# EAGLE design snappergps_board_2_2_0 (EAGLE 9.6.2)
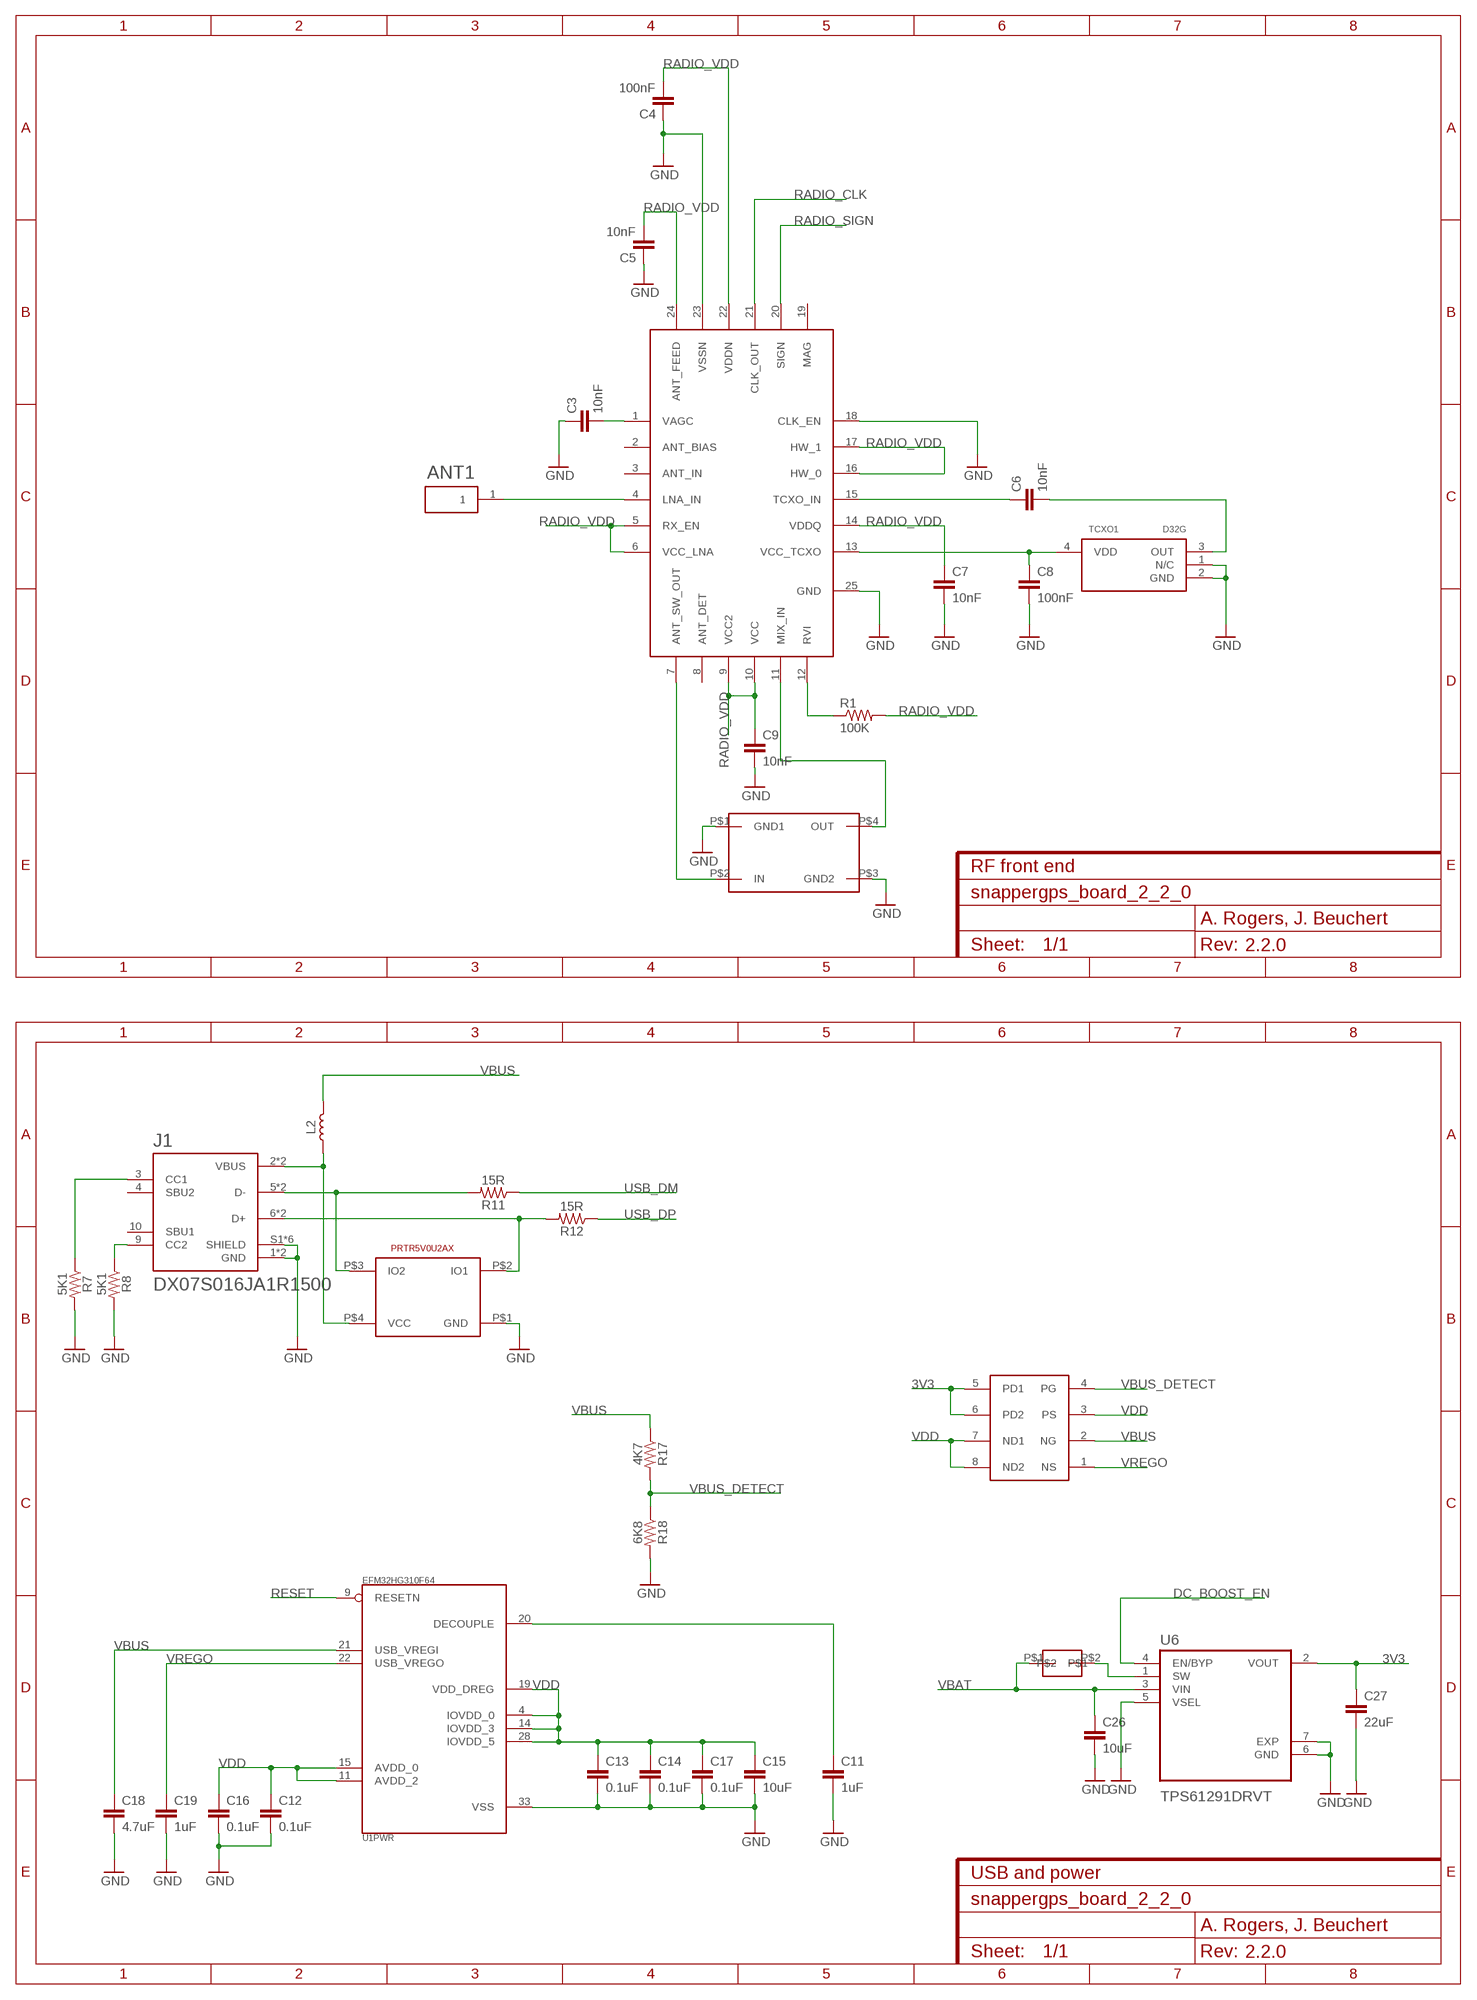
[diagram p0: schematic, sheet 1, part 1 of 2]
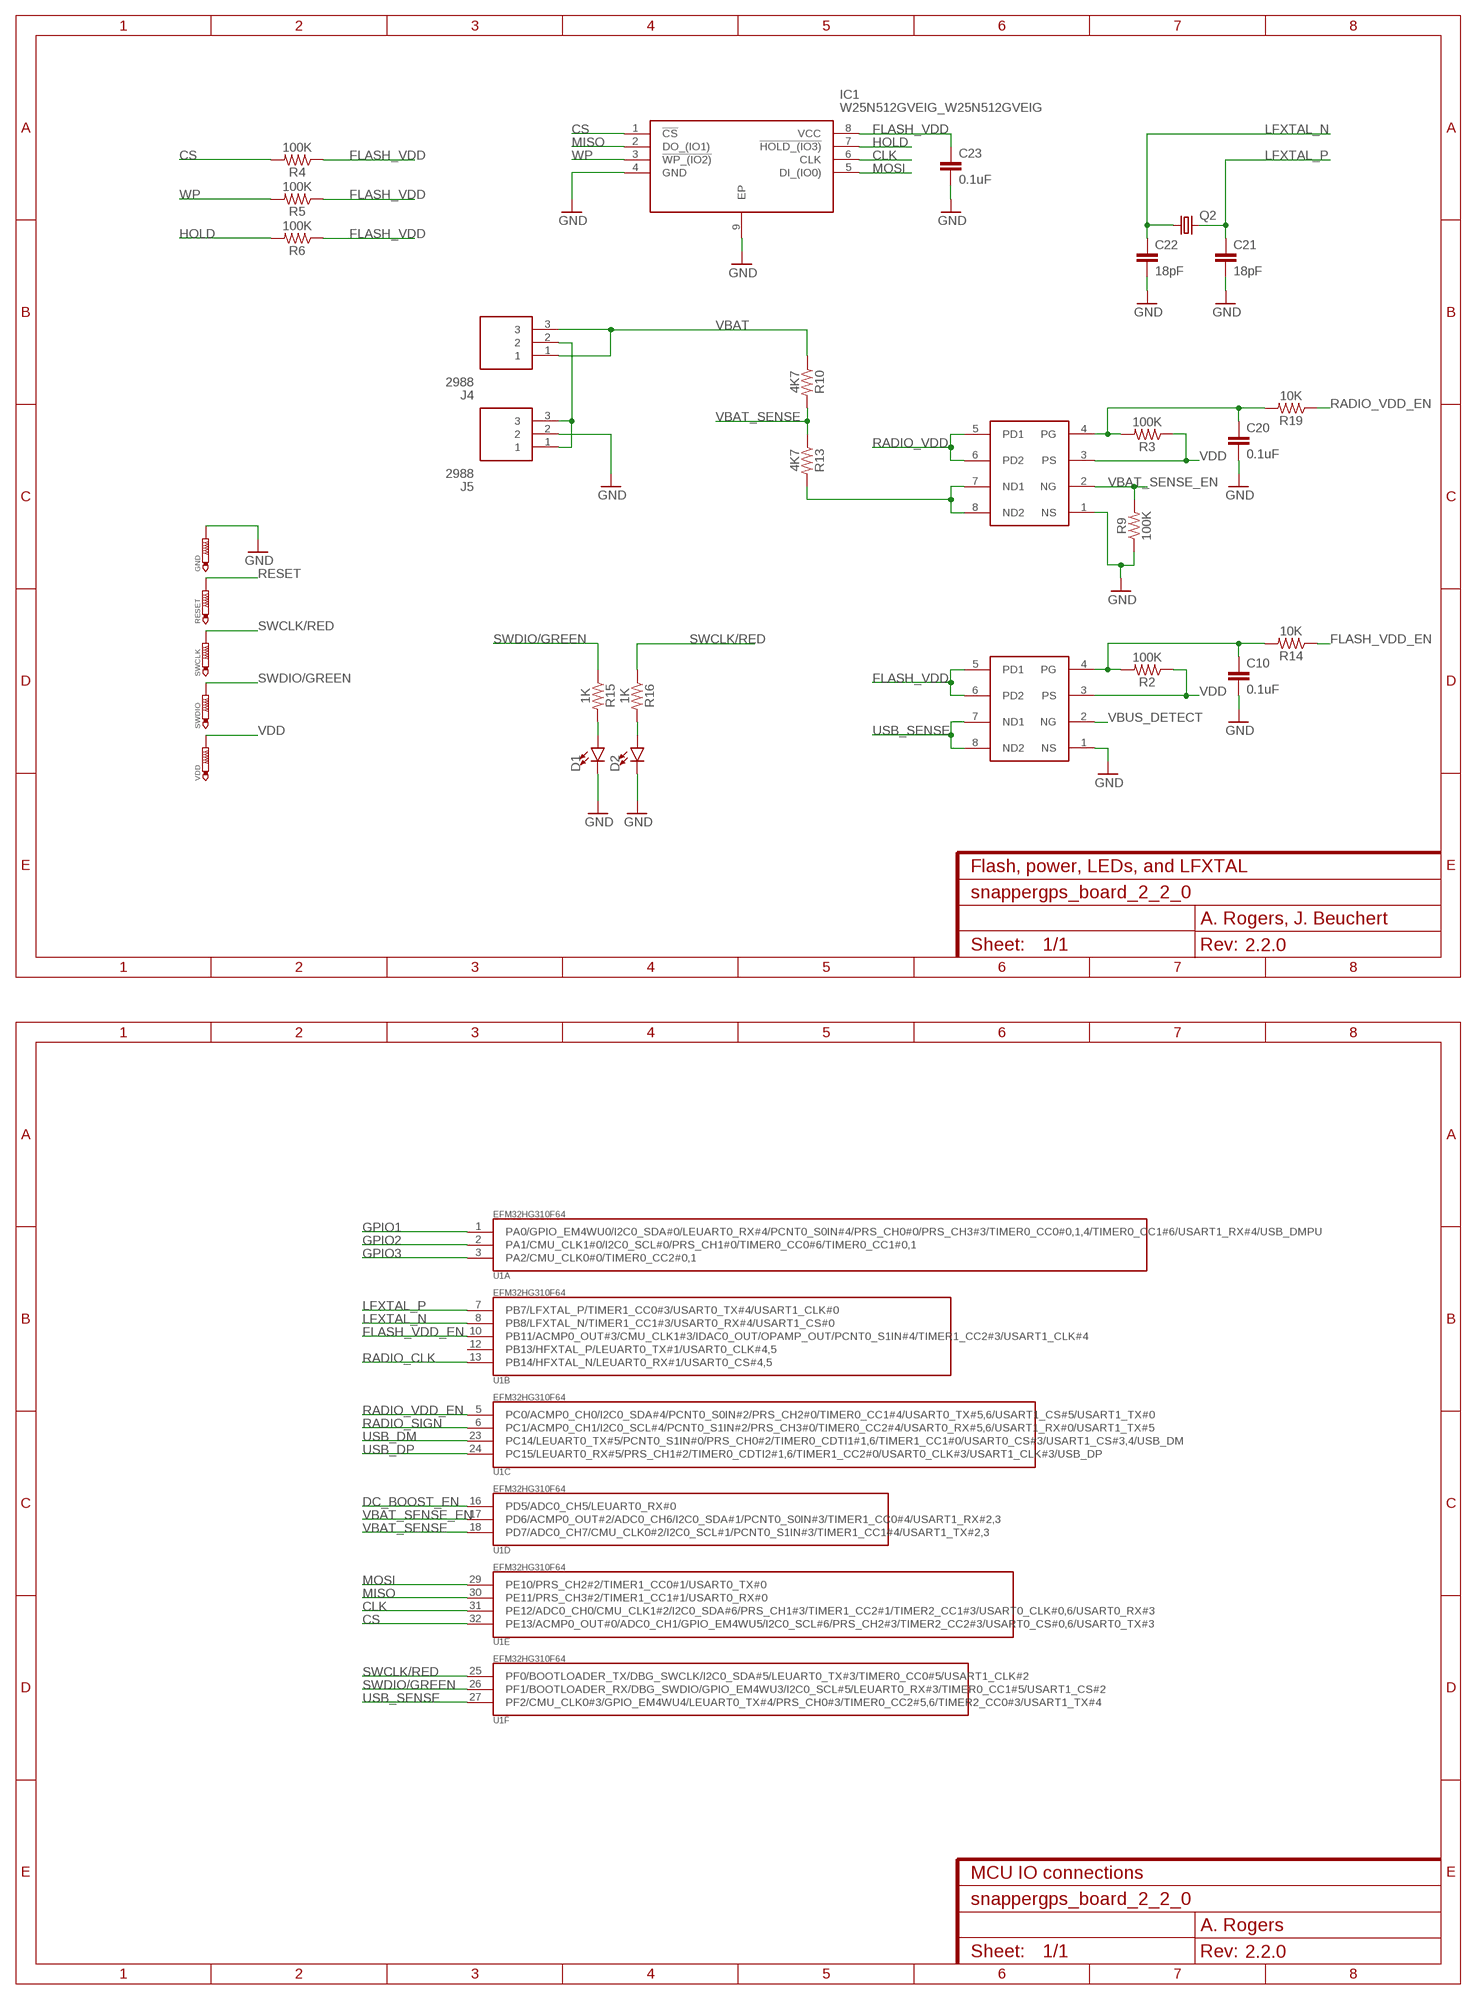
[diagram p1: schematic, sheet 1, part 2 of 2]
FRAME1 (FRAME-A4L): CNAME: RF front end; CREVISION: 2.2.0; DESIGNER: A. Rogers, J. Beuchert; REV: 2.2.0
FRAME2 (FRAME-A4L): CNAME: Flash, power, LEDs, and LFXTAL; CREVISION: 2.2.0; DESIGNER: A. Rogers, J. Beuchert
FRAME3 (FRAME-A4L): CNAME: USB and power; CREVISION: 2.2.0; DESIGNER: A. Rogers, J. Beuchert
FRAME4 (FRAME-A4L): CNAME: MCU IO connections; CREVISION: 2.2.0; DESIGNER: A. Rogers

## Parts
ANT1  GP.1575.25.2.A.02  [GP1575252A02]
C3  10nF  CAPACITOR_0402  [0402]
C4  100nF  CAPACITOR_0402  [0402]
C5  10nF  CAPACITOR_0402  [0402]
C6  10nF  CAPACITOR_0402  [0402]
C7  10nF  CAPACITOR_0402  [0402]
C8  100nF  CAPACITOR_0402  [0402]
C9  10nF  CAPACITOR_0402  [0402]
C10  0.1uF  CAPACITOR_0402  [0402]
C11  1uF  CAPACITOR_0603  [0603]
C12  0.1uF  CAPACITOR_0402  [0402]
C13  0.1uF  CAPACITOR_0402  [0402]
C14  0.1uF  CAPACITOR_0402  [0402]
C15  10uF  CAPACITOR_0603  [0603]
C16  0.1uF  CAPACITOR_0402  [0402]
C17  0.1uF  CAPACITOR_0402  [0402]
C18  4.7uF  CAPACITOR_0603  [0603]
C19  1uF  CAPACITOR_0603  [0603]
C20  0.1uF  CAPACITOR_0402  [0402]
C21  18pF  CAPACITOR_0402  [0402]
C22  18pF  CAPACITOR_0402  [0402]
C23  0.1uF  CAPACITOR_0402  [0402]
C26  10uF  C-EUC0603K  [C0603K]
C27  22uF  C-EUC0603K  [C0603K]
D1  LED0603  [LED-0603]
D2  LED0603  [LED-0603]
GND  PTR1B1,27  [B1,27]
IC1  W25N512GVEIG_W25N512GVEIG  [W25N512GVEIG_SON127P800X600X80-9N]
J1  DX07S016JA1R1500  [JAE_DX07S016JA1R1500]
J4  2988  [2988]
J5  2988  [2988]
L2  INDUCTOR  [0402]
Q1  TT8M1TRAMANDA  [AMANDA_TSST8]
Q2  CRYSTAL_JTX310  [3.2X1.5]
Q3  TT8M1TRAMANDA  [AMANDA_TSST8]
Q4  TT8M1TRAMANDA  [AMANDA_TSST8]
R1  100K  RESISTOR_0402  [0402]
R2  100K  RESISTOR_0402  [0402]
R3  100K  RESISTOR_0402  [0402]
R4  100K  RESISTOR_0402  [0402]
R5  100K  RESISTOR_0402  [0402]
R6  100K  RESISTOR_0402  [0402]
R7  5K1  RESISTOR_0402  [0402]
R8  5K1  RESISTOR_0402  [0402]
R9  100K  RESISTOR_0402  [0402]
R10  4K7  RESISTOR_0402  [0402]
R11  15R  RESISTOR_0402  [0402]
R12  15R  RESISTOR_0402  [0402]
R13  4K7  RESISTOR_0402  [0402]
R14  10K  RESISTOR_0402  [0402]
R15  1K  RESISTOR_0402  [0402]
R16  1K  RESISTOR_0402  [0402]
R17  4K7  RESISTOR_0402  [0402]
R18  6K8  RESISTOR_0402  [0402]
R19  10K  RESISTOR_0402  [0402]
RESET  PTR1B1,27  [B1,27]
SAW1  SAW_FILTER  [SAW_FILTER]
SWCLK  PTR1B1,27  [B1,27]
SWDIO  PTR1B1,27  [B1,27]
TCXO1  D32G  [D32G]
U1  EFM32HG310F64  [QFN32]
U2  RF_CIRCUIT-SE4150L  [QFN50P400X400X90-25N]
U3  TVS_DIODE-PRTR5V0U2AX  [TVS_DIODE-PRTR5V0U2AX]
U6  TPS61291DRVT  [SON65P200X200X80-7N]
U7  MDMK2020T3R3MM  [MDMK2020T3R3MM]
VDD  PTR1B1,27  [B1,27]

## Nets
3V3: C27.1 Q4.5(PD1) Q4.6(PD2) U6.2(VOUT)
CLK: IC1.6(CLK) U1.31(E:PE12/ADC0_CH0/CMU_CLK1#2/I2C0_SDA#6/PRS_CH1#3/TIMER1_CC2#1/TIMER2_CC1#3/USART0_CLK#0,6/USART0_RX#3)
CS: IC1.1(!CS) R4.2 U1.32(E:PE13/ACMP0_OUT#0/ADC0_CH1/GPIO_EM4WU5/I2C0_SCL#6/PRS_CH2#3/TIMER2_CC2#3/USART0_CS#0,6/USART0_TX#3)
DC_BOOST_EN: U1.16(D:PD5/ADC0_CH5/LEUART0_RX#0) U6.4(EN/BYP)
FLASH_VDD: C23.1 IC1.8(VCC) Q3.5(PD1) Q3.6(PD2) R4.1 R5.1 R6.1
FLASH_VDD_EN: R14.1 U1.10(B:PB11/ACMP0_OUT#3/CMU_CLK1#3/IDAC0_OUT/OPAMP_OUT/PCNT0_S1IN#4/TIMER1_CC2#3/USART1_CLK#4)
GND: C3.1 C4.1 C5.1 C7.2 C8.2 C9.2 C10.2 C11.2 C12.2 C13.2 C14.2 C15.2 C16.2 C17.2 C18.2 C19.2 C20.2 C21.2 C22.2 C23.2 C26.2 C27.2 D1.C D2.C GND.TP IC1.4(GND) IC1.9(EP) J1.1(GND) J1.12(GND) J1.S1(SHIELD) J1.S2(SHIELD) J1.S3(SHIELD) J1.S4(SHIELD) J1.S5(SHIELD) J1.S6(SHIELD) J5.2 Q1.1(NS) Q3.1(NS) R7.2 R8.2 R9.1 R18.2 SAW1.P$1(GND1) SAW1.P$3(GND2) TCXO1.1(N/C) TCXO1.2(GND) U1.33(PWR:VSS) U2.18(CLK_EN) U2.23(VSSN) U2.25(GND) U3.P$1(GND) U6.5(VSEL) U6.6(GND) U6.7(EXP)
GPIO1: U1.1(A:PA0/GPIO_EM4WU0/I2C0_SDA#0/LEUART0_RX#4/PCNT0_S0IN#4/PRS_CH0#0/PRS_CH3#3/TIMER0_CC0#0,1,4/TIMER0_CC1#6/USART1_RX#4/USB_DMPU)
GPIO2: U1.2(A:PA1/CMU_CLK1#0/I2C0_SCL#0/PRS_CH1#0/TIMER0_CC0#6/TIMER0_CC1#0,1)
GPIO3: U1.3(A:PA2/CMU_CLK0#0/TIMER0_CC2#0,1)
HOLD: IC1.7(!HOLD_(IO3)) R6.2
LFXTAL_N: C22.1 Q2.1 U1.8(B:PB8/LFXTAL_N/TIMER1_CC1#3/USART0_RX#4/USART1_CS#0)
LFXTAL_P: C21.1 Q2.2 U1.7(B:PB7/LFXTAL_P/TIMER1_CC0#3/USART0_TX#4/USART1_CLK#0)
MISO: IC1.2(DO_(IO1)) U1.30(E:PE11/PRS_CH3#2/TIMER1_CC1#1/USART0_RX#0)
MIXIN [rf]: SAW1.P$4(OUT) U2.11(MIX_IN)
MOSI: IC1.5(DI_(IO0)) U1.29(E:PE10/PRS_CH2#2/TIMER1_CC0#1/USART0_TX#0)
N$1: Q1.7(ND1) Q1.8(ND2) R13.2
N$2: C20.1 Q1.4(PG) R3.2 R19.2
N$3: J1.9(CC2) R8.1
N$4: J1.3(CC1) R7.1
N$5 [rf]: ANT1.1 U2.4(LNA_IN)
N$6: R1.1 U2.12(RVI)
N$7: U6.1(SW) U7.P$2
N$8 [rf]: SAW1.P$2(IN) U2.7(ANT_SW_OUT)
N$9: C8.1 TCXO1.4(VDD) U2.13(VCC_TCXO)
N$10: C6.1 U2.15(TCXO_IN)
N$11: C6.2 TCXO1.3(OUT)
N$13: C11.1 U1.20(PWR:DECOUPLE)
N$14: C10.1 Q3.4(PG) R2.2 R14.2
N$16: D1.A R15.2
N$17: D2.A R16.2
N$19: C3.2 U2.1(VAGC)
N$20: J4.2 J5.1 J5.3
N$26: J1.2(VBUS) J1.11(VBUS) L2.1 U3.P$4(VCC)
N$35: J1.6(D+) J1.7(D+) R12.2 U3.P$2(IO1)
N$36: J1.5(D-) J1.8(D-) R11.2 U3.P$3(IO2)
RADIO_CLK: U1.13(B:PB14/HFXTAL_N/LEUART0_RX#1/USART0_CS#4,5) U2.21(CLK_OUT)
RADIO_SIGN: U1.6(C:PC1/ACMP0_CH1/I2C0_SCL#4/PCNT0_S1IN#2/PRS_CH3#0/TIMER0_CC2#4/USART0_RX#5,6/USART1_RX#0/USART1_TX#5) U2.20(SIGN)
RADIO_VDD: C4.2 C5.2 C7.1 C9.1 Q1.5(PD1) Q1.6(PD2) R1.2 U2.5(RX_EN) U2.6(VCC_LNA) U2.9(VCC2) U2.10(VCC) U2.14(VDDQ) U2.16(HW_0) U2.17(HW_1) U2.22(VDDN) U2.24(ANT_FEED)
RADIO_VDD_EN: R19.1 U1.5(C:PC0/ACMP0_CH0/I2C0_SDA#4/PCNT0_S0IN#2/PRS_CH2#0/TIMER0_CC1#4/USART0_TX#5,6/USART1_CS#5/USART1_TX#0)
RESET: RESET.TP U1.9(PWR:RESETN)
SWCLK/RED: R16.1 SWCLK.TP U1.25(F:PF0/BOOTLOADER_TX/DBG_SWCLK/I2C0_SDA#5/LEUART0_TX#3/TIMER0_CC0#5/USART1_CLK#2)
SWDIO/GREEN: R15.1 SWDIO.TP U1.26(F:PF1/BOOTLOADER_RX/DBG_SWDIO/GPIO_EM4WU3/I2C0_SCL#5/LEUART0_RX#3/TIMER0_CC1#5/USART1_CS#2)
USB_DM: R11.1 U1.23(C:PC14/LEUART0_TX#5/PCNT0_S1IN#0/PRS_CH0#2/TIMER0_CDTI1#1,6/TIMER1_CC1#0/USART0_CS#3/USART1_CS#3,4/USB_DM)
USB_DP: R12.1 U1.24(C:PC15/LEUART0_RX#5/PRS_CH1#2/TIMER0_CDTI2#1,6/TIMER1_CC2#0/USART0_CLK#3/USART1_CLK#3/USB_DP)
USB_SENSE: Q3.7(ND1) Q3.8(ND2) U1.27(F:PF2/CMU_CLK0#3/GPIO_EM4WU4/LEUART0_TX#4/PRS_CH0#3/TIMER0_CC2#5,6/TIMER2_CC0#3/USART1_TX#4)
VBAT: C26.1 J4.1 J4.3 R10.1 U6.3(VIN) U7.P$1
VBAT_SENSE: R10.2 R13.1 U1.18(D:PD7/ADC0_CH7/CMU_CLK0#2/I2C0_SCL#1/PCNT0_S1IN#3/TIMER1_CC1#4/USART1_TX#2,3)
VBAT_SENSE_EN: Q1.2(NG) R9.2 U1.17(D:PD6/ACMP0_OUT#2/ADC0_CH6/I2C0_SDA#1/PCNT0_S0IN#3/TIMER1_CC0#4/USART1_RX#2,3)
VBUS: C18.1 L2.2 Q4.2(NG) R17.1 U1.21(PWR:USB_VREGI)
VBUS_DETECT: Q3.2(NG) Q4.4(PG) R17.2 R18.1
VDD: C12.1 C13.1 C14.1 C15.1 C16.1 C17.1 Q1.3(PS) Q3.3(PS) Q4.3(PS) Q4.7(ND1) Q4.8(ND2) R2.1 R3.1 U1.4(PWR:IOVDD_0) U1.11(PWR:AVDD_2) U1.14(PWR:IOVDD_3) U1.15(PWR:AVDD_0) U1.19(PWR:VDD_DREG) U1.28(PWR:IOVDD_5) VDD.TP
VREGO: C19.1 Q4.1(NS) U1.22(PWR:USB_VREGO)
WP: IC1.3(!WP_(IO2)) R5.2
Unconnected: J1.4(SBU2) J1.10(SBU1) U1.12(B:PB13/HFXTAL_P/LEUART0_TX#1/USART0_CLK#4,5) U2.2(ANT_BIAS) U2.3(ANT_IN) U2.8(ANT_DET) U2.19(MAG)

## Library data of the parts
ANT1 = GP.1575.25.2.A.02:GP.1575.25.2.A.02: Antennas GPS THRU-HL PIN PASV PTCH ANT Source: Datasheet <https://www.mouser.com/datasheet/2/398/GP.1575.25.2.A.02-1219629.pdf>; ARROW_PART_NUMBER: GP.1575.25.2.A.02; ARROW_PRICE-STOCK: https://www.arrow.com/en/products/gp.1575.25.2.a.02/taoglas?region=nac; DESCRIPTION: Antennas GPS THRU-HL PIN PASV PTCH ANT; HEIGHT: 2.8mm; MANUFACTURER_NAME: Taoglas; MANUFACTURER_PART_NUMBER: GP.1575.25.2.A.02; MOUSER_PART_NUMBER: 960-GP1575252A02; MOUSER_PRICE-STOCK: https://www.mouser.co.uk/ProductDetail/Taoglas/GP1575252A02?qs=WUa1z%2FNV9%252B0rNVEYL1BhmQ%3D%3D
C3-C23 = bird_variant_2:CAPACITOR
C26 C27 = rcl:C-EU: CAPACITOR, European symbol
D1 D2 = bird_variant_2:LED: LED (Generic) Standard schematic elements and footprints for 5mm, 3mm, 1206, and 0603 sized LEDs. Generic LEDs with no color specified.
GND RESET SWCLK SWDIO VDD = testpad:PTR1: TEST PIN
IC1 = snappergps_board_2_9_four_layers:W25N512GVEIG_W25N512GVEIG: NAND Flash 512Mb Serial NAND flash, 3V Source: Datasheet <https://www.winbond.com/resource-files/w25n512gv rev c 112118.pdf>; DESCRIPTION: NAND Flash 512Mb Serial NAND flash, 3V; HEIGHT: 0.8mm; MANUFACTURER_NAME: Winbond; MANUFACTURER_PART_NUMBER: W25N512GVEIG; MOUSER_PART_NUMBER: 454-W25N512GVEIG; MOUSER_PRICE-STOCK: https://www.mouser.co.uk/ProductDetail/Winbond/W25N512GVEIG/?qs=qSfuJ%252Bfl%2Fd5ygZJQb1vhdQ%3D%3D
J1 = DX07S016JA1R1500:DX07S016JA1R1500: USB-C (USB TYPE-C) USB 2.0 Receptacle Connector 24 (16+8 Dummy) Position Surface Mount, Right Angle; Through Hole Check prices <https://pricing.snapeda.com/parts/DX07S016JA1R1500/JAE%20Electronics/view-part?ref=eda>; AVAILABILITY: In Stock; DESCRIPTION: USB-C (USB TYPE-C) USB 2.0 Receptacle Connector 24 (16+8 Dummy) Position Surface Mount, Right Angle; Through Hole; MF: JAE Electronics; MP: DX07S016JA1R1500; PACKAGE: None; PRICE: None
J4 J5 = 2988:2988: KEYSTONE - 2988 - BATTERY CONTACT, 7.9MM HEAR AID CELL, SURFACE MT Source: Datasheet <https://compone2988Datasheet(PDF)ntsearchengine.com/Datasheets/1/2988.pdf>; DESCRIPTION: KEYSTONE - 2988 - BATTERY CONTACT, 7.9MM HEAR AID CELL, SURFACE MT; HEIGHT: 5.85mm; MANUFACTURER_NAME: Keystone Electronics; MANUFACTURER_PART_NUMBER: 2988; MOUSER_PART_NUMBER: 534-2988; MOUSER_PRICE-STOCK: https://www.mouser.co.uk/ProductDetail/Keystone-Electronics/2988?qs=poiiR8sYdC%252BudAsPvK4uKw%3D%3D
L2 = bird_variant_2:INDUCTOR
Q1 Q3 Q4 = TT8M1TR-dual-np-mosfet:TT8M1TR
Q2 = bird_variant_2:CRYSTAL_JTX310: 3.2x1.5 SMD crystal
R1-R19 = bird_variant_2:RESISTOR: Generic Resistor Package
SAW1 = bird_variant_2:SAW_FILTER
TCXO1 = TCXO_test_brd_2_2:D32G
U1 = EFM32:EFM32HG310F64: EFM32HG310F64 Happy Microcontroller in 6mm x 6mm QFN32 package
U2 = bird_variant_2:RF_CIRCUIT-SE4150L
U3 = bird_variant_2:TVS_DIODE-PRTR5V0U2AX
U6 = TPS61291DRVT:TPS61291DRVT: Check prices <https://pricing.snapeda.com/parts/TPS61291DRVT/Texas%20Instruments/view-part?ref=eda>; AVAILABILITY: Good; DESCRIPTION: Low Iq Boost Converter with 15nA Bypass Operation 6-WSON -40 to 85; MF: Texas Instruments; MP: TPS61291DRVT; PACKAGE: WSON-6 Texas Instruments; PRICE: None; PURCHASE-URL: https://pricing.snapeda.com/search/part/TPS61291DRVT/?ref=eda
U7 = alex:MDMK2020T3R3MM

## Net classes
0 default: width 0.152 mm, drill 0.305 mm, clearance 0.152 mm
2 rf: clearance 0.33 mm

## Board
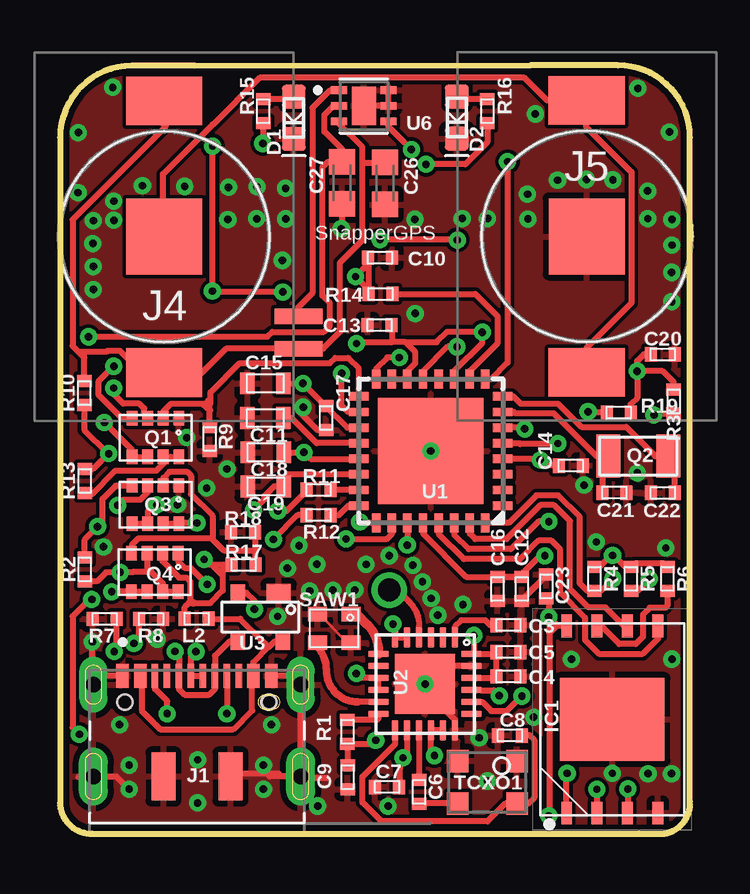
[diagram p2: board, top side]
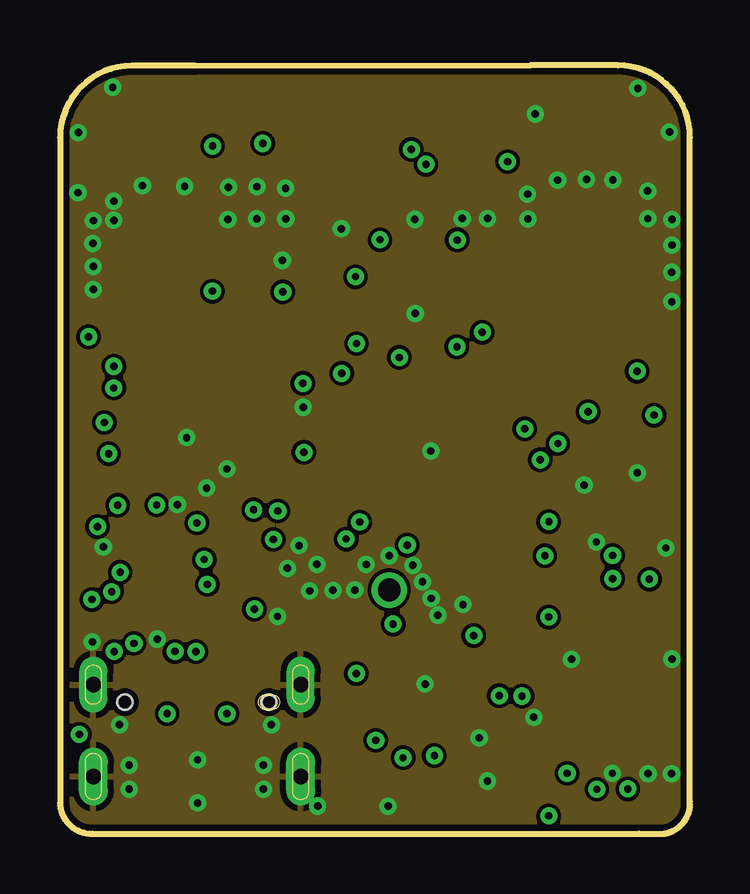
[diagram p3: board, inner layer Route2]
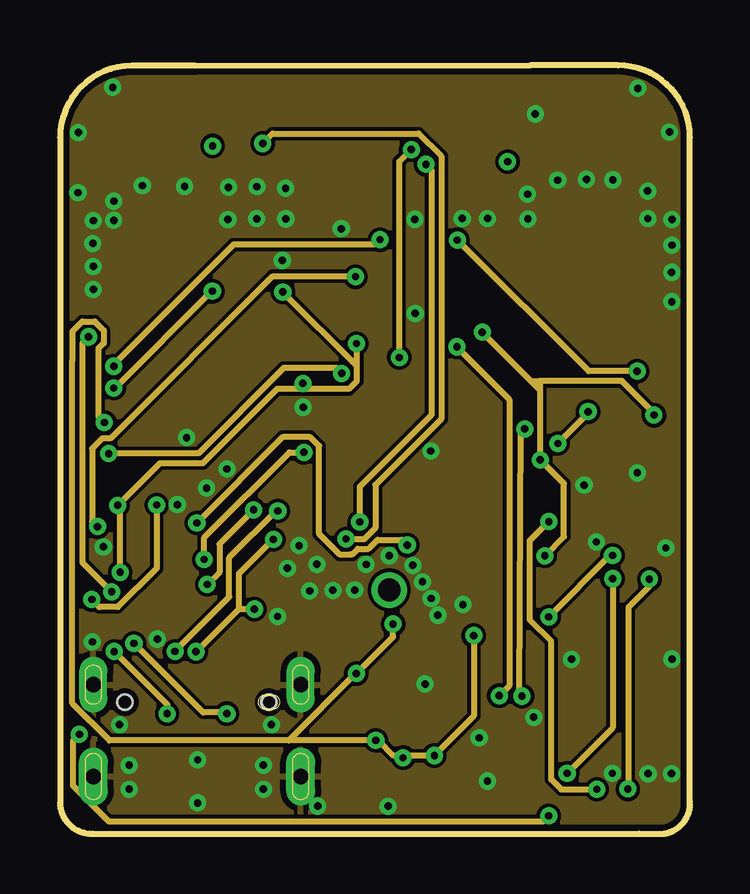
[diagram p4: board, inner layer Route15]
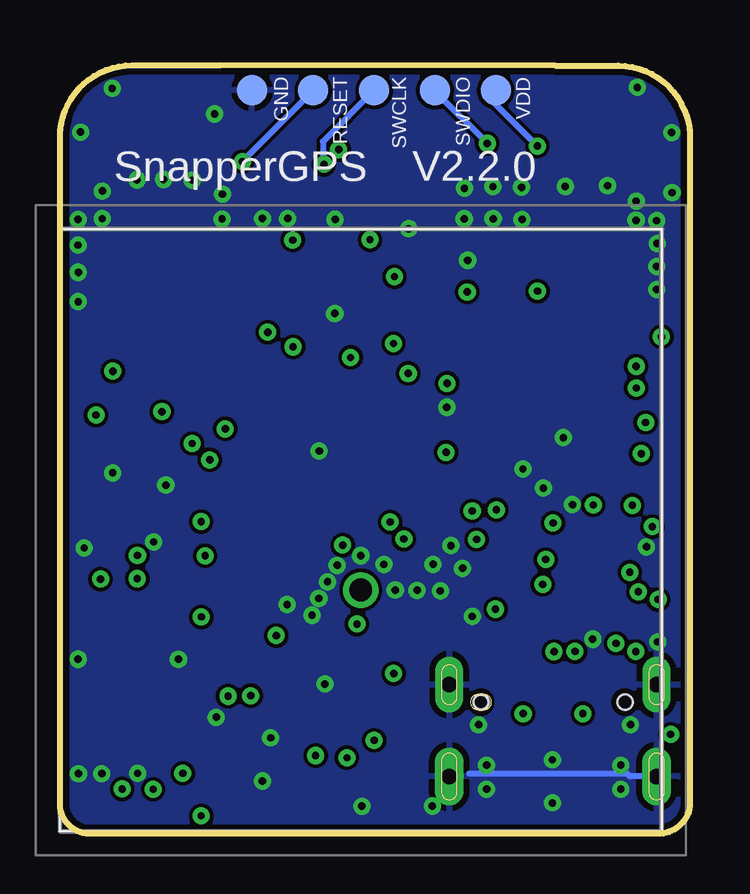
[diagram p5: board, bottom side, seen from below]

Size 26.27 x 32.03 mm. Coordinates in mm from the lower left corner, seen from the top.
Outline: 5.62,32.02 3,32.02 arc90 0,29.02 0,1.28 arc90 1.35,0 24.14,0 25.19,0 arc85 26.27,1.33 26.27,29.03 arc90 23.27,32.03 19.61,32.03 5.62,32.02
Copper layers (1+2*15+16): Top 0.035mm / dielectric 0.11mm / Route2 0.035mm / dielectric 0.4mm / Route15 0.035mm / dielectric 0.11mm / Bottom 0.035mm
Design rules "default *": minimum track width 10mil, minimum drill 18mil, track to track 6mil, track to pad 6mil, pad to pad 6mil, via to via 6mil, smd to smd 6mil, copper to edge 10mil, drill to drill 8mil, minimum pad ring 10mil, minimum via ring 8mil, stop-mask expansion 4mil, vias tented up to drill 20mil, thermal gap 10mil

### Footprints (pad centres in the part's own frame; a part is rotated, then mirrored left to right if it is on the bottom)
GP1575252A02 = drill 0.95 pad 1.478: 1 0,0
0402 = smd 0.5 x 0.6: 1 -0.5,0; 2 0.5,0
0603 = smd 0.6 x 0.9: 1 -0.75,0; 2 0.75,0
C0603K = smd 1.05 x 1.08: 1 -0.875,0; 2 0.875,0
LED-0603 = smd 1 x 1: A -0.877,0; C 0.877,0
B1,27 = smd 1.27 x 1.27: TP 0,0
W25N512GVEIG_SON127P800X600X80-9N = smd 0.95 x 0.45: 1 -3.9,1.905; 2 -3.9,0.635; 3 -3.9,-0.635; 4 -3.9,-1.905; 5 3.9,-1.905; 6 3.9,-0.635; 7 3.9,0.635; 8 3.9,1.905 | smd 3.45 x 4.35: 9 0,0
JAE_DX07S016JA1R1500 = smd 0.52 x 1: 1 -3.1,1.1; 2 -2.35,1.1; 11 2.35,1.1; 12 3.1,1.1 | smd 0.27 x 1: 3 -1.75,1.1; 4 -1.25,1.1; 5 -0.75,1.1; 6 -0.25,1.1; 7 0.25,1.1; 8 0.75,1.1; 9 1.25,1.1; 10 1.75,1.1 | smd 1 x 2: S1 -1.4,-3.1; S2 1.4,-3.1 | drill 0.65 long: S3 -4.32,0.725; S4 4.32,0.725 | drill 0.65 pad 1.2 long: S5 -4.32,-3.1; S6 4.32,-3.1 | hole 0.6: 3,0 | hole 0.63: 3,0; -3,0
2988 = smd 2.03 x 3.18: 1 -5.665,0; 3 5.665,0 | smd 3.17 x 3.17: 2 0,0
AMANDA_TSST8 = smd 0.45 x 0.6: 1 -0.975,-0.8; 2 -0.325,-0.8; 3 0.325,-0.8; 4 0.975,-0.8; 5 0.975,0.8; 6 0.325,0.8; 7 -0.325,0.8; 8 -0.975,0.8
3.2X1.5 = smd 1 x 1.8: 1 -1.25,0; 2 1.25,0
SAW_FILTER = smd 0.8 x 0.6: P$1 -0.7,0.6; P$2 -0.7,-0.6; P$3 0.7,-0.6; P$4 0.7,0.6
D32G = smd 0.94 x 0.89: 1 0.885,-1.24; 2 0.885,1.24; 3 -0.885,1.24; 4 -0.885,-1.24
QFN32 = smd 0.8 x 0.35: 1 -3,2.275; 2 -3,1.625; 3 -3,0.975; 4 -3,0.325; 5 -3,-0.325; 6 -3,-0.975; 7 -3,-1.625; 8 -3,-2.275; 17 3,-2.275; 18 3,-1.625; 19 3,-0.975; 20 3,-0.325; 21 3,0.325; 22 3,0.975; 23 3,1.625; 24 3,2.275 | smd 0.35 x 0.8: 9 -2.275,-3; 10 -1.625,-3; 11 -0.975,-3; 12 -0.325,-3; 13 0.325,-3; 14 0.975,-3; 15 1.625,-3; 16 2.275,-3; 25 2.275,3; 26 1.625,3; 27 0.975,3; 28 0.325,3; 29 -0.325,3; 30 -0.975,3; 31 -1.625,3; 32 -2.275,3 | smd 4.4 x 4.4: 33 0,0
QFN50P400X400X90-25N = smd 0.86 x 0.27: 1 -1.935,1.25; 2 -1.935,0.75; 3 -1.935,0.25; 4 -1.935,-0.25; 5 -1.935,-0.75; 6 -1.935,-1.25; 13 1.935,-1.25; 14 1.935,-0.75; 15 1.935,-0.25; 16 1.935,0.25; 17 1.935,0.75; 18 1.935,1.25 | smd 0.27 x 0.86: 7 -1.25,-1.935; 8 -0.75,-1.935; 9 -0.25,-1.935; 10 0.25,-1.935; 11 0.75,-1.935; 12 1.25,-1.935; 19 1.25,1.935; 20 0.75,1.935; 21 0.25,1.935; 22 -0.25,1.935; 23 -0.75,1.935; 24 -1.25,1.935 | smd 2.5 x 2.5: 25 0,0
TVS_DIODE-PRTR5V0U2AX = smd 1.016 x 0.711: P$1 -0.762,-1.016 | smd 0.61 x 0.686: P$2 0.94,-1.016; P$3 0.94,1.016; P$4 -0.94,1.016
SON65P200X200X80-7N = smd 0.66 x 0.32: 1 -1.025,0.65; 2 -1.025,0; 3 -1.025,-0.65; 4 1.025,-0.65; 5 1.025,0; 6 1.025,0.65 | smd 1 x 1.6: 7 0,0
MDMK2020T3R3MM = smd 2 x 0.65: P$1 0,0.675; P$2 0,-0.675

### Placement (x,y rotation side)
ANT1  13.73,10.16 0 bottom
C3  18.71,8.7 180 top
C4  18.71,6.56 180 top
C5  18.71,7.57 180 top
C6  14.97,1.74 270 top
C7  13.64,1.95 180 top
C8  18.77,4.1 180 top
C9  11.99,2.35 270 top
C10  13.34,24.02 0 top
C11  8.57,17.33 180 top
C12  19.26,10.2 270 top
C13  13.33,21.2 180 top
C14  21.3,15.35 0 top
C15  8.57,18.78 180 top
C16  18.24,10.2 270 top
C17  11.1,17.33 270 top
C18  8.58,15.9 180 top
C19  8.58,14.48 180 top
C20  25.13,19.98 0 top
C21  23.12,14.22 0 top
C22  25.14,14.21 180 top
C23  20.27,10.31 90 top
C26  13.55,27.11 270 top
C27  11.76,27.13 270 top
D1  9.75,29.84 270 top
D2  16.55,29.85 270 top
GND  18.25,30.99 90 bottom
IC1  23.03,4.76 90 top
J1  5.71,5.49 0 top
J4  4.35,24.89 90 top
J5  21.96,24.9 270 top
L2  5.71,8.96 180 top
Q1  3.98,16.51 180 top
Q2  24.12,15.74 180 top
Q3  3.98,13.72 180 top
Q4  3.96,10.9 180 top
R1  11.99,4.25 270 top
R2  1.04,11.02 90 top
R3  25.59,18.03 90 top
R4  22.28,10.63 270 top
R5  23.81,10.63 270 top
R6  25.33,10.63 270 top
R7  1.87,8.95 180 top
R8  3.8,8.95 0 top
R9  6.24,16.46 90 top
R10  1.02,18.37 270 top
R11  10.77,14.33 180 top
R12  10.78,13.28 180 top
R13  1.04,14.71 270 top
R14  13.36,22.5 180 top
R15  8.48,30.12 90 top
R16  17.82,30.13 90 top
R17  7.67,11.21 0 top
R18  7.64,12.57 180 top
R19  23.3,17.56 0 top
RESET  15.71,30.99 90 bottom
SAW1  11.44,8.56 180 top
SWCLK  13.17,30.99 90 bottom
SWDIO  10.63,30.99 90 bottom
TCXO1  17.82,2.14 90 top
U1  15.46,15.96 180 top
U2  15.23,6.24 270 top
U3  8.35,9.03 180 top
U6  12.67,30.34 0 top
U7  9.94,20.9 180 top
VDD  8.09,30.99 90 bottom

### Tracks (layer width: path | path; a pad name or v marks a point on that pad's centre or on a via)
3V3  (via drill 0.3)
  Top 0.254: Q4.6 Q4.5 2.17,10.1 v2.15,10.09 | U6.2 11.4,30.34 11.03,29.97 11.03,29.27 11.76,28.53 C27.1 11.16,28 10.94,27.78 10.94,22.43 11.26,22.11 11.26,21.17 11.01,20.92 8.84,20.92 8.64,20.71 v1.19,20.71
  Route15 0.254: v1.19,20.71 0.93,20.45 0.93,11.31 v2.15,10.09
CLK
  Top 0.254: IC1.6 23.51,8.66 22.74,9.44 22.03,9.44 21.26,10.2 21.26,13.04 20.6,13.7 20.03,13.7 18.62,12.29 18.62,12.28 17.32,12.28 17.09,12.51 U1.31
CS  (via drill 0.3)
  Top 0.254: IC1.1 21.12,2.52 v21.15,2.52 | v23.05,10.63 22.54,10.13 R4.2 21.98,10.13 21.67,10.44 21.67,13.22 20.78,14.1 19.86,14.1 18.71,12.96 U1.32
  Route15 0.254: v21.15,2.52 23.05,4.42 v23.05,10.63
DC_BOOST_EN  (via drill 0.3)
  Top 0.254: v14.15,19.85 13.65,19.85 13.19,19.39 U1.16 | v14.65,28.52 13.69,29.48 U6.4
  Route15 0.254: v14.65,28.52 14.14,28.02 14.14,19.86 v14.15,19.85
FLASH_VDD  (via drill 0.3)
  Top 0.254: R6.1 25.19,11.27 23.95,11.27 R5.1 23.58,11.13 23.1,11.6 v23.04,11.6 22.96,11.6 22.49,11.13 R4.1 | v4.03,13.7 3.92,13.7 3.66,13.44 Q3.6 Q3.5 | IC1.8 20.75,8.66 | 20.75,8.66 20.48,8.93 | 20.48,8.93 20.4,9.02 | C23.1 20.4,9.69 20.4,9.05 | 20.4,9.02 v20.38,9.03 20.4,9.05 | 20.4,9.02 20.4,8.35 | 20.4,8.35 20.4,0.76 v20.38,0.74 | v1.33,9.76 1.23,9.76 0.53,9.06 0.53,4.42 v0.81,4.14 | 20.75,8.66 20.71,8.66 20.4,8.35 | 20.4,8.35 | 20.4,9.05 20.48,9.13 20.48,8.93
  Route15 0.254: v20.38,9.03 20.38,9.05 22.93,11.6 v23.04,11.6 | v4.03,13.7 4.03,11.07 2.42,9.45 1.64,9.45 v1.33,9.76 | v0.81,4.14 0.53,3.87 0.53,2.01 2.03,0.51 20.15,0.51 v20.38,0.74
FLASH_VDD_EN
  Top 0.254: U1.10 17.09,19.29 18.25,20.45 18.25,21.57 17.32,22.5 R14.1
GND  (via drill 0.3)
  Top 0.127: 10.82,9.14 10.89,9.08 11.85,8.11 11.91,8.06 | 11.97,8 12.03,7.94
  Top 0.254: U2.23 14.59,6.99 U2.25 15.23,6 16.48,4.75 U2.18 | J1.1 1.88,6.59 1.39,6.1 J1.S3 1.35,6.21 v1.35,8 | J1.S5 1.32,2.31 | J1.S2 7.24,2.52 8.62,2.52 | 8.62,2.52 9.12,2.52 | J1.S6 10.11,2.31 11.12,2.31 | U6.6 U6.5 U6.7 | J1.S5 0.8,2.39 0.77,2.35 | C23.2 20.27,10.76 19.26,9.75 C12.2 | C27.2 11.76,25.22 v11.73,25.22 | J1.S6 J1.S4 9.66,6.59 J1.12 | J1.S5 2.35,2.39 v2.88,1.86 | J1.S6 8.75,2.39 8.62,2.52 | 10.84,9.16 SAW1.P$3 10.8,9.16 10.89,9.08 | C17.2 10.74,16.84 10.14,17.43 v10.14,17.78 | 12.12,7.96 SAW1.P$1 12,7.96 11.97,8 | 11.97,8 11.91,8.06 | 11.97,8 11.85,8.11
  Bottom 0.254: J1.S5 2.5,2.39 2.62,2.5 9.2,2.5
  other vias: 15.46,15.96 9.41,26.9 8.21,25.64 5.74,1.28 15.23,6.24 21.33,7.27 17.83,2.19 4.06,8.11 8.82,4.54 24.07,15.04 5.28,16.51 6.11,14.41 11.38,10.15 4.9,13.72 8.21,26.97 9.27,23.9 1.37,24.61 23.03,2.52 13.68,1.15 15.12,10.5 14.79,25.61 9.42,25.63 9.48,11.07 0.75,26.73 1.81,11.96 9.08,9.06 15.48,9.81 10.71,11.23 17.48,4 19.75,4.86 13.73,11.59 7.03,26.95 2.25,25.57 25.51,22.18 25.52,25.61 25.52,24.54 25.5,23.4 23.06,27.26 2.88,2.86 0.77,29.23 2.2,31.12 24.09,31.07 25.41,29.25 19.82,30.01 24.5,26.79 8.48,2.86 8.48,1.86 5.74,3.08 25.5,2.5 25.52,7.28 24.52,2.5 9.97,12.01 14.71,11.19 12.29,10.16 12.77,11.23 15.76,9.11 10.41,10.12 16.8,9.55 2.24,26.37 1.39,25.56 3.44,27.01 7,25.6 25.26,11.91 22.36,12.16 24.51,25.64 21.95,27.28 20.75,27.25 19.49,26.66 2.48,4.54 14.81,21.69 21.85,14.53 16.77,25.65 19.51,25.63 17.83,25.65 6.96,15.21 10.74,1.15 1.39,23.65 1.39,22.69 5.2,26.98
  pour Route2: -2.43,38.8 31.5,38.8 31.5,-1.08 -2.43,-1.08
  pour Top: -1.64,38.32 31.07,38.32 31.07,-0.76 -1.64,-0.76
  pour Bottom: -3.1,39.59 32.15,39.59 32.15,-1.6 -3.1,-1.6
  pour Route15: -2.82,39.25 31.91,39.25 31.91,-1.31 -2.82,-1.31
HOLD
  Top 0.254: IC1.7 22.57,8.66 23.32,7.91 24,7.91 24.31,8.21 24.31,9.13 24.59,9.42 25.24,9.42 25.33,9.51 R6.2
LFXTAL_N
  Top 0.254: U1.8 18.9,18.23 19.2,17.93 20.77,17.93 21.74,16.96 23.6,16.96 24.82,15.74 Q2.1 25.64,15.74 C22.1
LFXTAL_P
  Top 0.254: C21.1 22.62,15.5 Q2.2 22.37,15.74 20.59,17.52 18.97,17.52 18.91,17.58 U1.7
MISO  (via drill 0.3)
  Top 0.254: v22.39,1.85 v22.39,1.84 IC1.2 | U1.30 16.44,12.48 17.05,11.87 18.8,11.87 19.94,13.01 v20.38,13.01
  Route15 0.254: v22.39,1.85 20.9,1.85 20.49,2.26 20.49,8.01 19.58,8.91 19.58,12.21 v20.38,13.01
MIXIN
  Top 0.254: U2.11 12.43,5.49
  Top 0.305: 12.43,5.49 arc-90 11.11,6.82 arc45 10.67,7.86 SAW1.P$4 | SAW1.P$4 arc-90 10.64,7.96 SAW1.P$4
MOSI
  Top 0.254: IC1.5 24.93,8.13 24.3,7.5 22.46,7.5 21.89,8.07 21.89,9 20.86,10.03 20.86,11.85 20.48,12.22 19.96,12.22 19.19,11.45 16.84,11.45 15.79,12.51 U1.29
N$1
  Top 0.254: Q1.7 4.6,15.71 | 4.6,15.71 Q1.8 | 4.6,15.71 4.02,15.13 2.3,15.13 1.32,14.15 1.06,14.15 R13.2
N$2  (via drill 0.3)
  Top 0.254: v2.25,19.49 1.6,18.84 1.6,18.3 2.59,17.31 Q1.4 | v16.57,24.75 v16.57,24.76 16.57,24.76 v13.34,24.76 | v24.06,19.28 24.06,19.71 24.33,19.98 C20.1 | v24.06,19.28 v24.07,19.29 25.13,19.29 25.59,18.83 R3.2 | R19.2 23.8,17.9 24.06,18.17 v24.06,19.28
  Route15 0.254: v2.25,19.49 2.25,19.56 7.25,24.56 13.14,24.56 v13.34,24.76 | v24.06,19.28 22.05,19.28 16.58,24.75 v16.57,24.75
N$3  (via drill 0.3)
  Top 0.254: J1.9 v6.96,5 | R8.1 3.29,8.14 v3.08,7.93
  Route15 0.254: v3.08,7.93 v3.09,7.93 5.97,5.05 6.91,5.05 v6.96,5
N$4  (via drill 0.3)
  Top 0.254: J1.3 3.96,6.04 4.47,5.53 v4.47,5 | R7.1 2.35,8.94 2.35,7.69 v2.26,7.59
  Route15 0.254: v4.47,5 4.47,5.38 v2.26,7.59
N$5
  Top 0.254: U2.4 14.98,8.65 arc45 14.55,9.68 14.32,9.91 arc45 ANT1.1
N$6
  Top 0.254: U2.12 13.29,4.82 13.21,4.74 R1.1
N$7
  Top 0.254: U6.1 11.27,30.99 10.53,30.26 10.53,22.54 9.94,21.95 U7.P$2
N$8
  Top 0.381: U2.7 13.29,7.59 arc45 12.83,8.71 12.38,9.16 SAW1.P$2
N$9
  Top 0.254: C8.1 19.58,4.1 19.78,3.9 19.78,1.5 19.54,1.26 TCXO1.4 18.58,1.26 17.83,0.51 13.41,0.51 12.61,1.31 12.61,2.37 13.98,3.73 U2.13
N$10
  Top 0.254: U2.15 14.99,4.29 14.97,4.27 C6.1
N$11
  Top 0.254: TCXO1.3 15,1.26 C6.2
N$13
  Top 0.254: C11.1 9.66,17.33 10.71,16.28 U1.20
N$14  (via drill 0.3)
  Top 0.254: R2.2 1.04,12.27 v1.57,12.8 | Q3.4 2.99,14.5 2.32,14.5 1.77,13.95 1.77,13 v1.57,12.8 | v1.57,12.8 | C10.1 12.86,24 R14.2 12.86,22.69 v12.32,23.22 12.84,23.74 C10.1
  Route15 0.254: v1.57,12.8 1.55,12.8 1.34,13.02 1.34,16.05 1.77,16.48 2.11,16.48 8.87,23.24 12.3,23.24 v12.32,23.22
N$16
  Top 0.254: D1.A 9.64,30.62 R15.2
N$17
  Top 0.254: D2.A 16.65,30.63 R16.2
N$19
  Top 0.254: C3.2 17.93,8.7 17.73,8.89 16.73,8.89 16.48,8.64 U2.1
N$20
  Top 0.254: J4.2 4.3,24.94 4.3,27.5 6.36,29.56 6.38,29.56 8.33,31.51 19.37,31.51 20.32,30.57 J5.1 21.94,30.54 21.94,30.23 21.94,29.48 23.83,27.59 23.83,22.13 21.96,20.27 J5.3
N$26
  Top 0.254: J1.2 3.42,6.54 3.42,5.12 4.18,4.36 7.24,4.36 8.01,5.14 8.01,6.54 8.02,6.54 J1.11 8.07,7.14 8.7,7.78 | L2.1 7.52,8.96 8.53,7.95 8.63,7.86 8.7,7.78 | 8.7,7.78 8.71,7.78 8.95,8.02 U3.P$4
N$35  (via drill 0.3)
  Top 0.254: J1.7 J1.6 5.46,7.38 v5.67,7.59 | R12.2 9.91,13.28 v8.9,12.27 | v8.11,9.36 | v8.11,9.36 8.11,9.72 7.78,10.05 U3.P$2
  Route15 0.254: 7.46,9.38 7.46,10.84 v8.89,12.27 v8.9,12.27 | v8.1,9.37 v8.11,9.36 8.09,9.38 7.46,9.38 | v5.67,7.59 7.46,9.38
N$36  (via drill 0.3)
  Top 0.254: v4.8,7.6 4.96,7.43 J1.5 4.96,6.02 5.2,5.79 6.22,5.79 6.46,6.03 J1.8 6.46,7.41 7.06,8.02 U3.P$3 | v9.08,13.46 9.09,13.45 9.44,13.45 10.27,14.28 R11.2
  Route15 0.254: v4.8,7.6 5.04,7.84 5.04,7.85 7.06,9.87 7.06,11.51 9,13.46 v9.08,13.46
RADIO_CLK  (via drill 0.3)
  Top 0.254: U1.13 15.14,19.27 16.16,20.3 v16.55,20.3 | v18.32,5.75 18.09,5.98 17.54,5.98 17.53,5.99 U2.21
  Route15 0.254: v18.32,5.75 18.73,6.16 18.73,18.11 v16.55,20.29 v16.55,20.3
RADIO_SIGN  (via drill 0.3)
  Top 0.254: v19.38,16.88 19.38,16.93 U1.6 | U2.20 17.61,5.49 17.98,5.12 18.64,5.12 v19.26,5.74
  Route15 0.254: v19.26,5.74 19.14,5.86 19.2,16.88 v19.38,16.88
RADIO_VDD  (via drill 0.3)
  Top 0.254: v17.25,8.26 17.25,7.58 U2.24 18.17,7.49 18.19,7.51 | U2.22 18.21,6.49 C4.2 18.19,6.58 18.19,7.51 | U2.17 U2.16 15.48,3.39 v15.61,3.26 | v13.17,3.89 13.02,3.74 11.99,3.74 R1.2 11.99,2.86 C9.1 | C7.1 14.17,1.97 14.17,2.71 14.18,2.71 14.18,3.04 v14.31,3.17 | C5.2 18.19,7.55 18.19,7.51 | U2.14 14.48,3.34 v14.31,3.17 | v14.31,3.17 | Q1.6 Q1.5 3.01,15.99 1.86,17.14 v1.85,17.14 | U2.5 U2.6 13.98,8.65 v13.89,8.74 | U2.10 U2.9 12.54,6.49 v12.36,6.68
  Route15 0.254: 14.4,3.26 v15.61,3.26 17.25,4.91 v17.25,8.26 | 14.4,3.26 13.91,3.26 13.27,3.89 v13.17,3.89 9.54,3.89 | 14.4,3.26 v14.31,3.17 | 9.54,3.89 2.06,3.89 0.52,5.43 0.52,19.74 0.52,20.95 0.93,21.35 1.46,21.35 1.83,20.98 1.83,20.45 1.6,20.23 1.6,17.39 v1.85,17.14 | v13.89,8.74 13.89,8.21 v12.36,6.68 12.33,6.68 9.54,3.89
RADIO_VDD_EN  (via drill 0.3)
  Top 0.254: U1.5 19.15,16.28 19.19,16.24 20.76,16.24 v20.76,16.27 | R19.1 22.06,17.56 v22.02,17.59
  Route15 0.254: v22.02,17.59 22.02,17.52 v20.76,16.27
RESET  (via drill 0.3)
  Top 0.254: U1.9 17.98,18.96 18.66,19.63 v18.66,28.02
  Bottom 0.254: RESET.TP 15.71,30.98 v18.66,28.03 v18.66,28.02
SWCLK/RED  (via drill 0.3)
  Top 0.254: U1.25 12.54,12.96 v12.5,12.99 | v15.26,27.91 16.9,27.91 17.82,28.82 R16.1
  Route15 0.254: v12.5,12.99 12.5,14.47 15.48,17.45 15.48,27.69 v15.26,27.91
  Bottom 0.254: SWCLK.TP 15.31,28.85 15.31,27.95 v15.26,27.91
SWDIO/GREEN  (via drill 0.3)
  Top 0.254: U1.26 13.84,12.49 13.61,12.27 11.95,12.27 v11.93,12.29 | R15.1 8.48,28.8 v8.46,28.78
  Route15 0.254: v11.93,12.29 12.69,12.29 13.15,12.74 13.15,14.54 15.91,17.3 15.91,28.24 14.96,29.19 8.87,29.19 v8.46,28.78
  Bottom 0.254: v8.46,28.78 10.63,30.96 SWDIO.TP
USB_DM
  Top 0.254: U1.23 12.08,14.32 12.07,14.33 R11.1
USB_DP
  Top 0.254: R12.1 11.63,13.28 12.03,13.68 U1.24
USB_SENSE  (via drill 0.3)
  Top 0.254: v5.71,12.96 5,12.96 Q3.8 Q3.7 | U1.27 v14.49,12.04 v14.48,12.03
  Route15 0.254: v5.71,12.96 9.29,16.54 10.43,16.54 10.81,16.16 10.81,12.49 11.65,11.64 12.12,11.64 12.12,11.65 12.19,11.65 12.42,11.88 12.86,11.88 13.24,12.26 14.26,12.26 v14.48,12.03
VBAT
  Top 0.254: 12.6,27.98 C26.1 | U6.3 11.64,29.59 12.6,28.63 12.6,27.98 | 12.6,27.98 12.6,24.74 11.68,23.82 11.68,20.93 10.97,20.22 U7.P$1 6.93,20.22 5.9,19.19 5.02,19.19 4.41,19.8 4.35,19.73 J4.1 3.41,19.22 2.51,20.12 1.98,20.12 1.94,20.08 1.02,20.08 | 4.4,29.47 4.4,29.89 4.35,29.94 J4.3 4.35,29.52 4.4,29.47 | 4.4,29.47 0.52,25.59 0.52,20.34 0.78,20.08 | 1.02,20.08 0.78,20.08 | R10.1 1.02,19.84 | 1.02,19.84 1.02,20.08 | 0.78,20.08 1.02,19.84
VBAT_SENSE  (via drill 0.3)
  Top 0.254: v11.75,19.19 11.73,19.17 11.73,17.86 12.01,17.58 U1.18 | R10.2 1.02,16.83 2.01,15.85 v2.03,15.85 2.02,15.85 1.38,15.21 R13.1
  Route15 0.254: v2.03,15.85 v2.05,15.86 5.78,15.86 9.33,19.41 11.53,19.41 v11.75,19.19
VBAT_SENSE_EN
  Top 0.254: Q1.2 4.31,17.61 4.62,17.92 5.96,17.92 5.96,17.91 | R9.2 6.24,17.88 6.28,17.92 6.1,17.81 | 6.1,17.81 6.16,18.03 6.16,18.04 6.28,18.15 | 5.96,17.91 6.26,17.65 6.1,17.81 | 5.96,17.91 6.28,17.91 6.28,18.15 | 6.28,18.15 6.28,18.39 7.5,19.61 11.26,19.61 11.48,19.84 12.01,19.84 12.46,19.39 U1.17
VBUS  (via drill 0.3)
  Top 0.254: C18.1 10.03,15.9 v10.17,15.9 10.18,15.9 10.45,15.63 U1.21 | Q4.2 4.28,11.36 4.96,10.68 5.27,10.68 5.44,10.51 5.44,9.79 | 5.44,9.79 5.61,9.62 5.61,9.6 | 6.35,11.21 R17.1 6.9,11.21 6.79,11.1 6.79,10.77 | 6.35,11.21 6.24,11.21 v6.01,11.43 | 5.61,9.6 6.27,9.6 6.27,9.62 6.79,10.14 6.79,10.62 6.79,10.77 | 5.44,9.79 5.44,9.68 | L2.2 5.21,9.45 5.35,9.6 | 5.35,9.6 5.44,9.68 | 5.44,9.68 5.52,9.6 | 5.52,9.6 5.61,9.6 | 5.52,9.6 5.35,9.6 | 6.35,11.21 6.79,10.77
  Route15 0.254: v10.17,15.9 9.57,15.9 6.01,12.34 v6.01,11.43
VBUS_DETECT
  Top 0.254: Q4.4 3,11.74 3,12.05 3.26,12.3 6.32,12.3 6.36,12.27 | 6.36,12.27 6.81,11.81 8.14,11.81 | Q3.2 4.31,14.73 4.31,14.84 4.57,15.1 5.3,15.1 5.46,14.93 5.46,14.15 6.36,13.26 6.36,12.27 | R18.1 8.14,11.81 | 8.14,11.81 8.14,11.23 R17.2
VDD  (via drill 0.3)
  Top 0.254: C16.1 C12.1 19.26,10.84 | U1.19 11.98,16.93 11.08,17.84 | U1.15 U1.14 14.49,19.28 14.82,19.62 14.82,20.08 14.42,20.49 | U1.4 19.98,15.63 v20.02,15.59 20.27,15.35 C14.1 | Q4.8 Q4.7 4.28,10.44 3.8,10.92 3.6,10.92 | Q3.3 3.66,14.23 3.35,13.92 2.64,13.92 v2.41,13.69 | 3.6,10.92 3.07,10.92 3.06,10.91 2.53,10.91 v2.51,10.9 1.92,10.9 1.54,10.52 1.52,10.52 R2.1 | Q4.3 3.63,10.95 3.6,10.92 | v20.22,11.59 20.01,11.59 19.26,10.84 | 19.26,10.84 19.11,10.69 19.11,10.83 18.99,10.71 16.94,10.71 15.14,12.51 U1.28 | v9.29,22.59 6.39,22.59 v6.36,22.62 v6.37,22.62 v6.37,28.67 | 14.42,20.49 13.84,20.49 | 13.84,20.49 12.42,20.49 v12.36,20.43 | 17.53,20.96 17.61,20.96 v17.61,20.91 | v17.61,20.91 17.61,20.46 16.44,19.29 U1.11 | C15.1 v10.12,18.78 v10.13,18.77 10.14,18.77 11.08,17.84 | C13.1 13.84,20.49 | 14.42,20.49 15.71,20.49 16.15,20.93 17.61,20.93 v17.61,20.91 | Q1.3 3.51,17.46 3.51,17.73 3.31,17.93 2.64,17.93 2.24,18.33 v2.24,18.58 | v24.77,17.45 24.84,17.52 R3.1 | C17.1 11.08,17.84
  Route15 0.254: 20.02,18.86 20.02,18.5 | 20.02,18.5 v20.02,15.59 v20.03,15.59 21.02,14.6 21.02,12.38 v20.22,11.59 | v6.36,22.62 6.33,22.62 2.3,18.58 v2.24,18.58 | v10.13,18.77 10.36,18.55 | 10.36,18.55 12.05,18.55 12.38,18.88 12.38,19.49 | v2.51,10.9 2.5,10.91 2.5,13.6 v2.41,13.69 4.17,15.45 5.96,15.45 9.06,18.55 10.36,18.55 | v12.36,20.43 12.38,20.43 12.38,19.49 | 20.02,18.86 20.01,18.87 23.44,18.87 24.77,17.54 v24.77,17.45 | v17.61,20.91 v17.61,20.9 19.65,18.86 | 19.65,18.86 20,18.5 20.02,18.5 | v9.29,22.59 12.38,19.49 | 20.02,18.86 19.65,18.86
  Bottom 0.254: v6.37,28.67 8.17,30.47 8.17,30.76 8.15,30.73 8.15,30.99 VDD.TP
VREGO  (via drill 0.3)
  Top 0.254: Q4.1 4.93,11.34 5.19,11.08 5.44,11.08 v6.13,10.39 v6.14,10.39 | v8.07,13.5 8.53,13.95 8.53,14.07 8.93,14.48 C19.1 9.33,14.84 9.47,14.98 U1.22
  Route15 0.254: v8.07,13.5 6.65,12.08 6.65,10.9 v6.14,10.39
WP  (via drill 0.3)
  Top 0.254: R5.2 24.09,10.13 v24.58,10.61 | IC1.3 23.68,0.88 v23.68,1.86
  Route15 0.254: v23.68,1.86 23.71,1.89 23.71,9.44 24.58,10.31 v24.58,10.61

### Text on the board
tPlace: SnapperGPS
bPlace: V2.2.0 | SnapperGPS